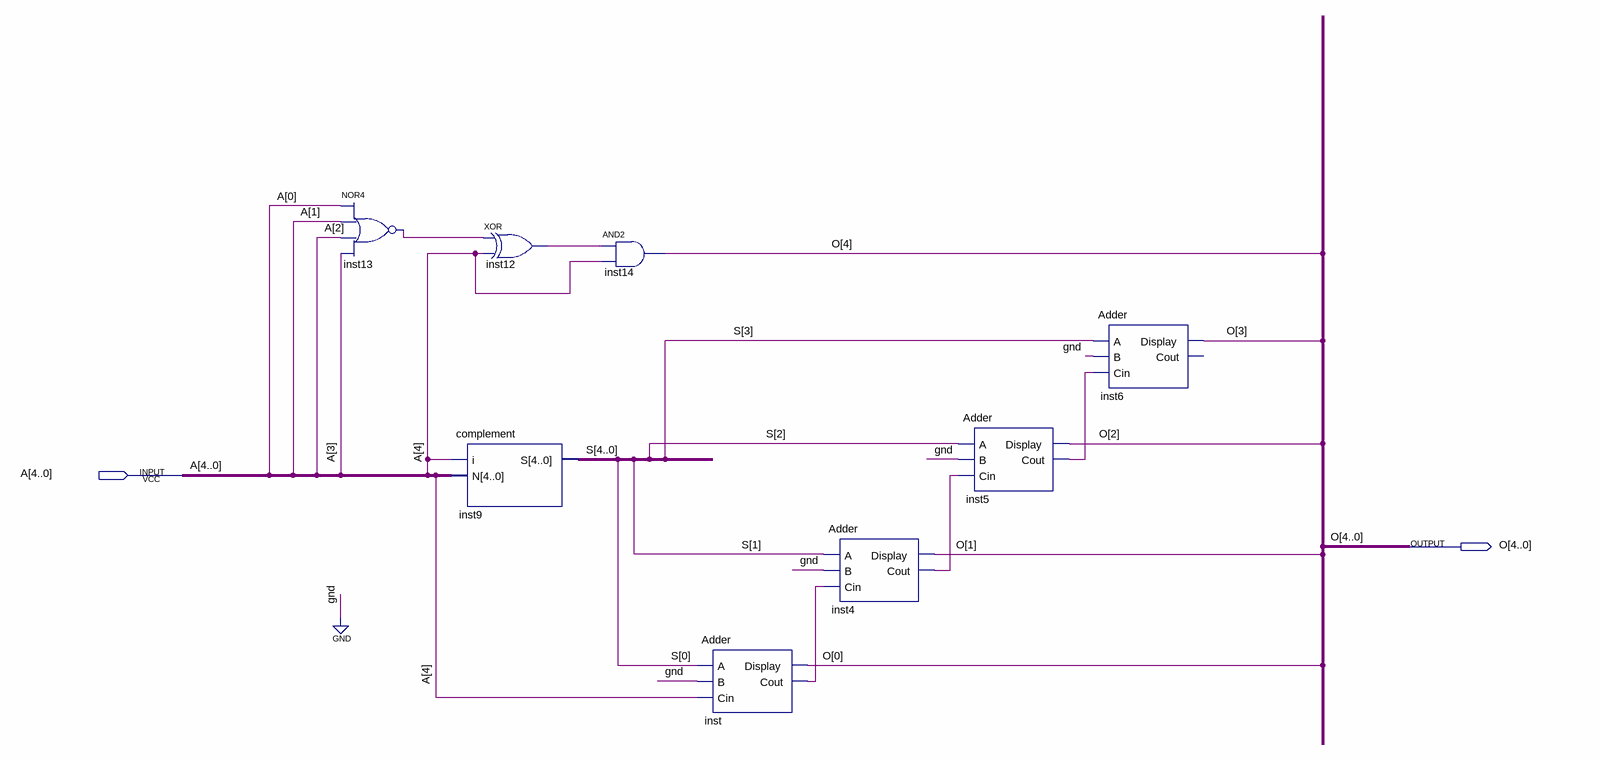
[diagram p0: schematic sheet]
// Quartus schematic AURA2.bdf as structural Verilog: 8 symbols, 2 pins
module AURA2 (
  input  [4:0] A,
  output [4:0] O
);

  wire inst4_cout, inst5_cout, inst12_out, inst13_out, inst_cout;
  wire [4:0] S;

  nor inst13 (inst13_out, A[0], A[1], A[2], A[3]);
  complement inst9 (.i(A[4]), .N(A), .S(S));
  xor inst12 (inst12_out, inst13_out, A[4]);
  and inst14 (O[4], inst12_out, A[4]);
  Adder inst (.A(S[0]), .B(1'b0), .Cin(A[4]), .Display(O[0]), .Cout(inst_cout));
  Adder inst4 (.A(S[1]), .B(1'b0), .Cin(inst_cout), .Display(O[1]), .Cout(inst4_cout));
  Adder inst5 (.A(S[2]), .B(1'b0), .Cin(inst4_cout), .Display(O[2]), .Cout(inst5_cout));
  Adder inst6 (.A(S[3]), .B(1'b0), .Cin(inst5_cout), .Display(O[3]));  // open: Cout
endmodule
